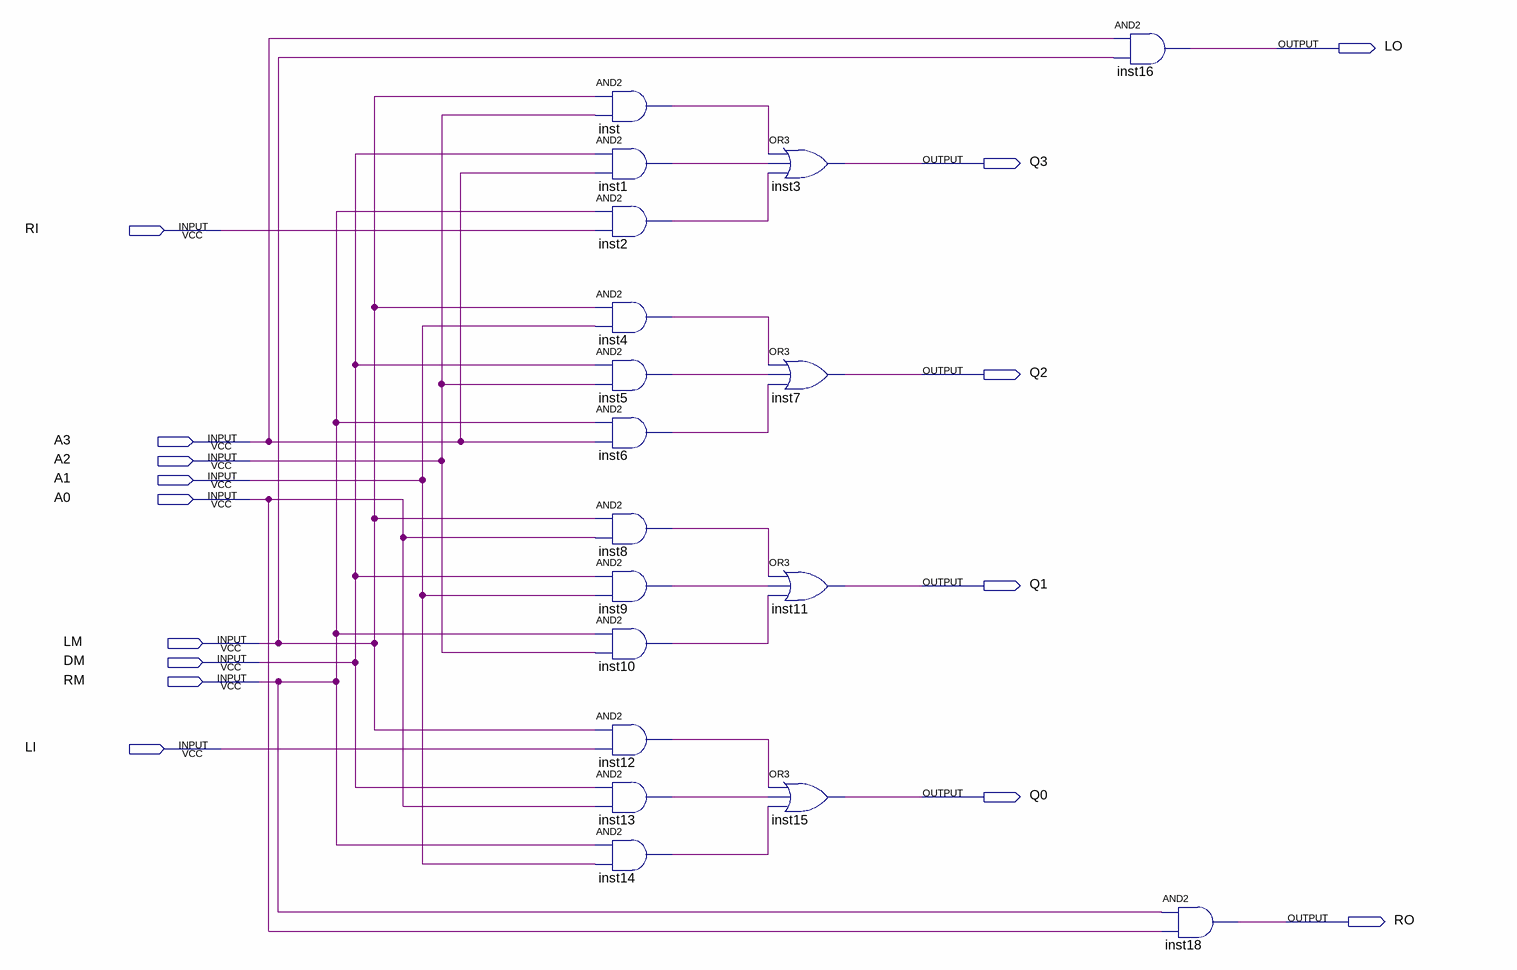
[diagram p0: schematic sheet]
// Quartus schematic shifter_4.bdf as structural Verilog: 18 symbols, 15 pins
module shifter_4 (
  input  RI,
  input  A3,
  input  A2,
  input  A1,
  input  A0,
  input  LM,
  input  DM,
  input  RM,
  input  LI,
  output LO,
  output Q3,
  output Q2,
  output Q1,
  output Q0,
  output RO
);

  wire inst1_out, inst2_out, inst4_out, inst5_out, inst6_out, inst8_out, inst9_out, inst10_out, inst12_out,
       inst13_out, inst14_out, inst_out;

  and inst (inst_out, LM, A2);
  and inst1 (inst1_out, DM, A3);
  and inst2 (inst2_out, RM, RI);
  and inst4 (inst4_out, LM, A1);
  and inst5 (inst5_out, DM, A2);
  and inst6 (inst6_out, RM, A3);
  and inst8 (inst8_out, LM, A0);
  and inst9 (inst9_out, DM, A1);
  and inst10 (inst10_out, RM, A2);
  and inst12 (inst12_out, LM, LI);
  and inst13 (inst13_out, DM, A0);
  and inst14 (inst14_out, RM, A1);
  or inst3 (Q3, inst_out, inst1_out, inst2_out);
  or inst7 (Q2, inst4_out, inst5_out, inst6_out);
  or inst11 (Q1, inst8_out, inst9_out, inst10_out);
  or inst15 (Q0, inst12_out, inst13_out, inst14_out);
  and inst16 (LO, A3, LM);
  and inst18 (RO, RM, A0);
endmodule
